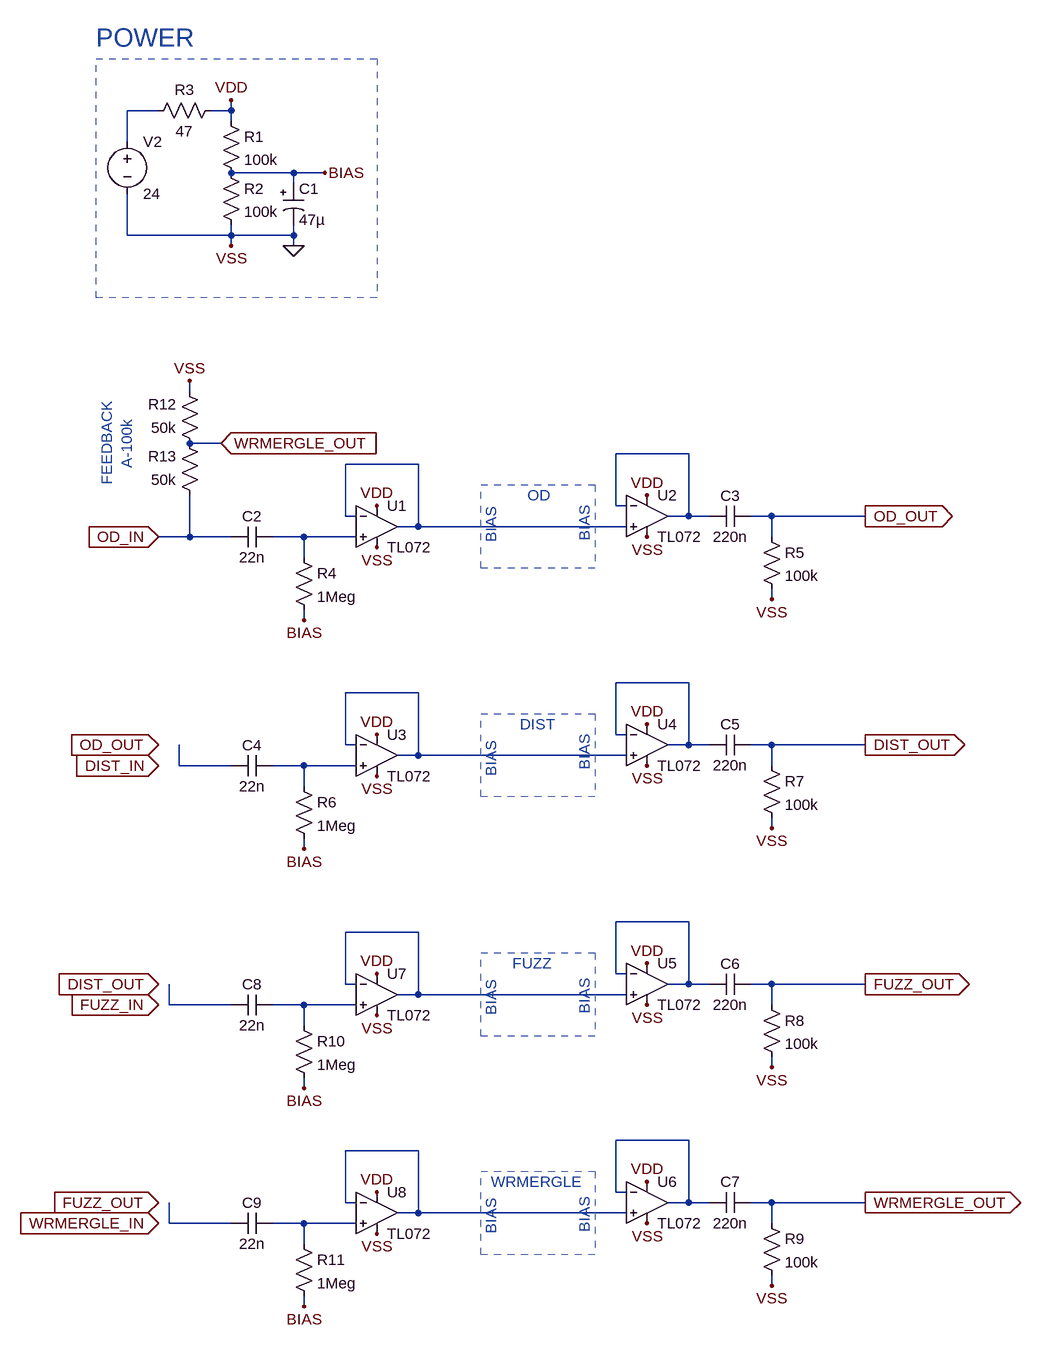
[diagram p0: schematic structure.asc]
structure.asc, the LTspice schematic file:
Version 4.1
SHEET 1 880 1896
WIRE -480 -48 -528 -48
WIRE -368 -48 -368 -64
WIRE -368 -48 -400 -48
WIRE -368 -32 -368 -48
WIRE -528 0 -528 -48
WIRE -272 48 -368 48
WIRE -224 48 -272 48
WIRE -272 64 -272 48
WIRE -528 144 -528 80
WIRE -368 144 -368 128
WIRE -368 144 -528 144
WIRE -272 144 -272 128
WIRE -272 144 -368 144
WIRE -368 160 -368 144
WIRE -272 160 -272 144
WIRE -432 384 -432 368
WIRE -384 464 -432 464
WIRE 336 480 224 480
WIRE -80 496 -192 496
WIRE 224 560 224 480
WIRE 240 560 224 560
WIRE -192 576 -192 496
WIRE -176 576 -192 576
WIRE 336 576 336 480
WIRE 336 576 304 576
WIRE 368 576 336 576
WIRE 464 576 432 576
WIRE 608 576 464 576
WIRE -80 592 -80 496
WIRE -80 592 -112 592
WIRE 240 592 -80 592
WIRE -432 608 -432 544
WIRE -432 608 -480 608
WIRE -368 608 -432 608
WIRE -256 608 -304 608
WIRE -176 608 -256 608
WIRE 464 608 464 576
WIRE -256 640 -256 608
WIRE 464 704 464 688
WIRE -256 736 -256 720
WIRE 336 832 224 832
WIRE -80 848 -192 848
WIRE 224 912 224 832
WIRE 240 912 224 912
WIRE -192 928 -192 848
WIRE -176 928 -192 928
WIRE 336 928 336 832
WIRE 336 928 304 928
WIRE 368 928 336 928
WIRE 464 928 432 928
WIRE 608 928 464 928
WIRE -80 944 -80 848
WIRE -80 944 -112 944
WIRE 240 944 -80 944
WIRE -448 960 -448 928
WIRE -368 960 -448 960
WIRE -256 960 -304 960
WIRE -176 960 -256 960
WIRE 464 960 464 928
WIRE -256 992 -256 960
WIRE 464 1056 464 1040
WIRE -256 1088 -256 1072
WIRE 336 1200 224 1200
WIRE -80 1216 -192 1216
WIRE 224 1280 224 1200
WIRE 240 1280 224 1280
WIRE -192 1296 -192 1216
WIRE -176 1296 -192 1296
WIRE 336 1296 336 1200
WIRE 336 1296 304 1296
WIRE 368 1296 336 1296
WIRE 464 1296 432 1296
WIRE 608 1296 464 1296
WIRE -80 1312 -80 1216
WIRE -80 1312 -112 1312
WIRE 240 1312 -80 1312
WIRE -464 1328 -464 1296
WIRE -368 1328 -464 1328
WIRE -256 1328 -304 1328
WIRE -176 1328 -256 1328
WIRE 464 1328 464 1296
WIRE -256 1360 -256 1328
WIRE 464 1424 464 1408
WIRE -256 1456 -256 1440
WIRE 336 1536 224 1536
WIRE -80 1552 -192 1552
WIRE 224 1616 224 1536
WIRE 240 1616 224 1616
WIRE -192 1632 -192 1552
WIRE -176 1632 -192 1632
WIRE 336 1632 336 1536
WIRE 336 1632 304 1632
WIRE 368 1632 336 1632
WIRE 464 1632 432 1632
WIRE 608 1632 464 1632
WIRE -80 1648 -80 1552
WIRE -80 1648 -112 1648
WIRE 240 1648 -80 1648
WIRE -464 1664 -464 1632
WIRE -368 1664 -464 1664
WIRE -256 1664 -304 1664
WIRE -176 1664 -256 1664
WIRE 464 1664 464 1632
WIRE -256 1696 -256 1664
WIRE 464 1760 464 1744
WIRE -256 1792 -256 1776
FLAG -224 48 BIAS
FLAG -368 160 VSS
FLAG -368 -64 VDD
FLAG -272 160 0
FLAG -144 560 VDD
FLAG -144 624 VSS
FLAG -480 608 OD_IN
IOPIN -480 608 In
FLAG -256 736 BIAS
FLAG 272 544 VDD
FLAG 272 608 VSS
FLAG 608 576 OD_OUT
IOPIN 608 576 Out
FLAG 464 704 VSS
FLAG -144 912 VDD
FLAG -144 976 VSS
FLAG -256 1088 BIAS
FLAG 272 896 VDD
FLAG 272 960 VSS
FLAG 608 928 DIST_OUT
IOPIN 608 928 Out
FLAG 464 1056 VSS
FLAG 272 1264 VDD
FLAG 272 1328 VSS
FLAG 608 1296 FUZZ_OUT
IOPIN 608 1296 Out
FLAG 464 1424 VSS
FLAG 272 1600 VDD
FLAG 272 1664 VSS
FLAG 608 1632 WRMERGLE_OUT
IOPIN 608 1632 Out
FLAG 464 1760 VSS
FLAG -144 1280 VDD
FLAG -144 1344 VSS
FLAG -256 1456 BIAS
FLAG -144 1616 VDD
FLAG -144 1680 VSS
FLAG -256 1792 BIAS
FLAG -480 960 DIST_IN
IOPIN -480 960 In
FLAG -480 1328 FUZZ_IN
IOPIN -480 1328 In
FLAG -480 1664 WRMERGLE_IN
IOPIN -480 1664 In
FLAG -480 928 OD_OUT
IOPIN -480 928 In
FLAG -480 1296 DIST_OUT
IOPIN -480 1296 In
FLAG -480 1632 FUZZ_OUT
IOPIN -480 1632 In
FLAG -384 464 WRMERGLE_OUT
IOPIN -384 464 In
FLAG -432 368 VSS
SYMBOL voltage -528 -16 R0
WINDOW 123 0 0 Left 0
WINDOW 39 0 0 Left 0
SYMATTR InstName V2
SYMATTR Value 24
SYMBOL res -384 -48 R0
SYMATTR InstName R1
SYMATTR Value 100k
SYMBOL res -384 32 R0
SYMATTR InstName R2
SYMATTR Value 100k
SYMBOL polcap -288 64 R0
SYMATTR InstName C1
SYMATTR Value 47µ
SYMBOL res -384 -64 R90
WINDOW 0 0 56 VBottom 2
WINDOW 3 32 56 VTop 2
SYMATTR InstName R3
SYMATTR Value 47
SYMBOL OpAmps\\opamp2 -144 528 R0
SYMATTR InstName U1
SYMATTR Value TL072
SYMBOL cap -304 592 R90
WINDOW 0 0 32 VBottom 2
WINDOW 3 32 32 VTop 2
SYMATTR InstName C2
SYMATTR Value 22n
SYMBOL res -272 624 R0
SYMATTR InstName R4
SYMATTR Value 1Meg
SYMBOL OpAmps\\opamp2 272 512 R0
SYMATTR InstName U2
SYMATTR Value TL072
SYMBOL cap 432 560 R90
WINDOW 0 0 32 VBottom 2
WINDOW 3 32 32 VTop 2
SYMATTR InstName C3
SYMATTR Value 220n
SYMBOL res 448 592 R0
SYMATTR InstName R5
SYMATTR Value 100k
SYMBOL OpAmps\\opamp2 -144 880 R0
SYMATTR InstName U3
SYMATTR Value TL072
SYMBOL cap -304 944 R90
WINDOW 0 0 32 VBottom 2
WINDOW 3 32 32 VTop 2
SYMATTR InstName C4
SYMATTR Value 22n
SYMBOL res -272 976 R0
SYMATTR InstName R6
SYMATTR Value 1Meg
SYMBOL OpAmps\\opamp2 272 864 R0
SYMATTR InstName U4
SYMATTR Value TL072
SYMBOL cap 432 912 R90
WINDOW 0 0 32 VBottom 2
WINDOW 3 32 32 VTop 2
SYMATTR InstName C5
SYMATTR Value 220n
SYMBOL res 448 944 R0
SYMATTR InstName R7
SYMATTR Value 100k
SYMBOL OpAmps\\opamp2 272 1232 R0
SYMATTR InstName U5
SYMATTR Value TL072
SYMBOL cap 432 1280 R90
WINDOW 0 0 32 VBottom 2
WINDOW 3 32 32 VTop 2
SYMATTR InstName C6
SYMATTR Value 220n
SYMBOL res 448 1312 R0
SYMATTR InstName R8
SYMATTR Value 100k
SYMBOL OpAmps\\opamp2 272 1568 R0
SYMATTR InstName U6
SYMATTR Value TL072
SYMBOL cap 432 1616 R90
WINDOW 0 0 32 VBottom 2
WINDOW 3 32 32 VTop 2
SYMATTR InstName C7
SYMATTR Value 220n
SYMBOL res 448 1648 R0
SYMATTR InstName R9
SYMATTR Value 100k
SYMBOL OpAmps\\opamp2 -144 1248 R0
SYMATTR InstName U7
SYMATTR Value TL072
SYMBOL cap -304 1312 R90
WINDOW 0 0 32 VBottom 2
WINDOW 3 32 32 VTop 2
SYMATTR InstName C8
SYMATTR Value 22n
SYMBOL res -272 1344 R0
SYMATTR InstName R10
SYMATTR Value 1Meg
SYMBOL OpAmps\\opamp2 -144 1584 R0
SYMATTR InstName U8
SYMATTR Value TL072
SYMBOL cap -304 1648 R90
WINDOW 0 0 32 VBottom 2
WINDOW 3 32 32 VTop 2
SYMATTR InstName C9
SYMATTR Value 22n
SYMBOL res -272 1680 R0
SYMATTR InstName R11
SYMATTR Value 1Meg
SYMBOL res -416 480 R180
WINDOW 0 36 76 Left 2
WINDOW 3 36 40 Left 2
SYMATTR InstName R12
SYMATTR Value 50k
SYMBOL res -416 560 R180
WINDOW 0 36 76 Left 2
WINDOW 3 36 40 Left 2
SYMATTR InstName R13
SYMATTR Value 50k
TEXT -576 -160 Left 4 ;POWER
TEXT 88 544 Left 2 ;OD
TEXT 104 896 Center 2 ;DIST
TEXT 96 1264 Center 2 ;FUZZ
TEXT 32 1600 Left 2 ;WRMERGLE
TEXT 32 616 VLeft 2 ;BIAS
TEXT 32 976 VLeft 2 ;BIAS
TEXT 32 1344 VLeft 2 ;BIAS
TEXT 32 1680 VLeft 2 ;BIAS
TEXT 176 1288 VRight 2 ;BIAS
TEXT 176 912 VRight 2 ;BIAS
TEXT 176 560 VRight 2 ;BIAS
TEXT 176 1624 VRight 2 ;BIAS
TEXT -544 464 VCenter 2 ;FEEDBACK\nA-100k
RECTANGLE Normal -144 240 -576 -128 1
RECTANGLE Normal 192 656 16 528 1
RECTANGLE Normal 192 1008 16 880 1
RECTANGLE Normal 192 1376 16 1248 1
RECTANGLE Normal 192 1712 16 1584 1

The netlist it stands for:
* structure.asc
V2 N001 0 24
R1 VDD BIAS 100k
R2 BIAS 0 100k
C1 BIAS 0 47µ
R3 VDD N001 47
X§U1 N004 N003 VDD 0 N003 TL072  ; pins In+ In- V+ V- OUT
C2 N004 OD_IN 22n
R4 N004 BIAS 1Meg
X§U2 N003 N002 VDD 0 N002 TL072  ; pins In+ In- V+ V- OUT
C3 OD_OUT N002 220n
R5 OD_OUT 0 100k
X§U3 N008 N006 VDD 0 N006 TL072  ; pins In+ In- V+ V- OUT
C4 N008 N007 22n
R6 N008 BIAS 1Meg
X§U4 N006 N005 VDD 0 N005 TL072  ; pins In+ In- V+ V- OUT
C5 DIST_OUT N005 220n
R7 DIST_OUT 0 100k
X§U5 N010 N009 VDD 0 N009 TL072  ; pins In+ In- V+ V- OUT
C6 FUZZ_OUT N009 220n
R8 FUZZ_OUT 0 100k
X§U6 N014 N013 VDD 0 N013 TL072  ; pins In+ In- V+ V- OUT
C7 WRMERGLE_OUT N013 220n
R9 WRMERGLE_OUT 0 100k
X§U7 N012 N010 VDD 0 N010 TL072  ; pins In+ In- V+ V- OUT
C8 N012 N011 22n
R10 N012 BIAS 1Meg
X§U8 N016 N014 VDD 0 N014 TL072  ; pins In+ In- V+ V- OUT
C9 N016 N015 22n
R11 N016 BIAS 1Meg
R12 WRMERGLE_OUT 0 50k
R13 OD_IN WRMERGLE_OUT 50k
* POWER
* OD
* DIST
* FUZZ
* WRMERGLE
* BIAS
* BIAS
* BIAS
* BIAS
* BIAS
* BIAS
* BIAS
* BIAS
* FEEDBACK
* A-100k
.backanno
.end